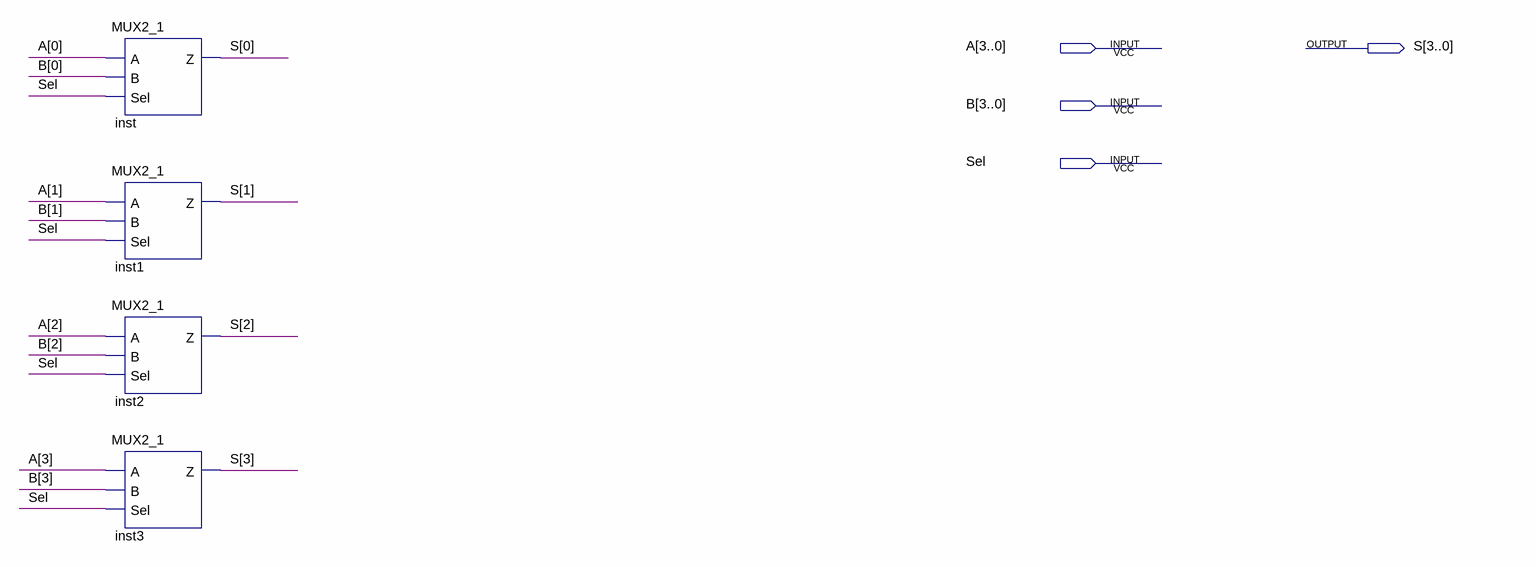
[diagram p0: schematic sheet]
// Quartus schematic MUX.bdf as structural Verilog: 4 symbols, 4 pins
module MUX (
  input  [3:0] A,
  input  [3:0] B,
  input  Sel,
  output [3:0] S
);

  MUX2_1 inst (.A(A[0]), .B(B[0]), .Sel(Sel), .Z(S[0]));
  MUX2_1 inst1 (.A(A[1]), .B(B[1]), .Sel(Sel), .Z(S[1]));
  MUX2_1 inst2 (.A(A[2]), .B(B[2]), .Sel(Sel), .Z(S[2]));
  MUX2_1 inst3 (.A(A[3]), .B(B[3]), .Sel(Sel), .Z(S[3]));
endmodule
